# Altium schematic sheet edison_misc.SchDoc: Edison Gateway - Misc
size Letter; Author: Ye-Sheng Kuo; DocumentNumber: 5; Revision: 3; SheetNumber: 5; SheetTotal: 10
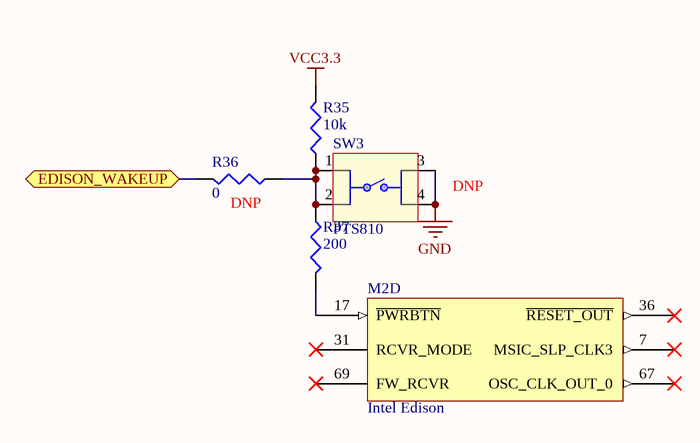
[diagram p0: edison_misc.SchDoc]

## Parts
M2  Intel Edison  [Intel Edison mating]  (part D of 5)
R35  10k  [0402]
R36  Note: DNP  [0402]  (hidden comment: 0)
R37  200  [0402]
SW3  PTS810  Note: DNP  [PTS810]

## Ports
EDISON_WAKEUP

## Nets
GND: SW3.3 SW3.4
VCC3.3: R35.1
EDISON_WAKEUP: R36.1 ; port EDISON_WAKEUP
NetM2_17: M2.17(~{PWRBTN}) R37.1
NetR35_2: R35.2 R36.2 R37.2 SW3.1 SW3.2

Not connected (* = marked no-connect by the designer): M2 7(MSIC_SLP_CLK3)* 31(RCVR_MODE)* 36(~{RESET_OUT})* 67(OSC_CLK_OUT_0)* 69(FW_RCVR)*

## Notes on the sheet
- Title
- Date:
- Author:
- Revision:
- Sheet
- of
- University of Michigan
- File:

## Library data of the parts
M2 = Intel Edison: Note: Mating connector: H124603CT-ND
R35 = CRCW040210K0FKED: RES SMD 10K OHM 1% 1/16W 0402; Manufacturer: Vishay Dale; Temperature Coefficient: 100 ppm/C; Tolerance: 1%; Power: 1/16 W; package: 0402; Supplier 1: Digi-Key; Supplier Part Number 1: 541-10.0KLCT-ND; value: 10k; Manufacturer Part Number: CRCW040210K0FKED
R36 = CRCW04020000Z0EDHP: RES SMD 0.0 OHM JUMPER 1/5W 0402; Manufacturer: Vishay Dale; Temperature Coefficient: NA; package: 0402; Supplier 1: Digi-Key; Supplier Part Number 1: 541-0.0YBCT-ND; value: 0; Manufacturer Part Number: CRCW04020000Z0EDHP; Power: 1/5 W; Tolerance: NA
R37 = CRCW0402200RFKED: RES SMD 200 OHM 1% 1/16W 0402; Manufacturer: Vishay Dale; Temperature Coefficient: 100 ppm/C; Tolerance: 1%; Power: 1/16 W; package: 0402; Supplier 1: Digi-Key; Supplier Part Number 1: 541-200LCT-ND; value: 200; Manufacturer Part Number: CRCW0402200RFKED
SW3 = PTS810: Tactile Switches; Supplier 1: Digi-Key; Supplier Part Number 1: CKN10504CT-ND